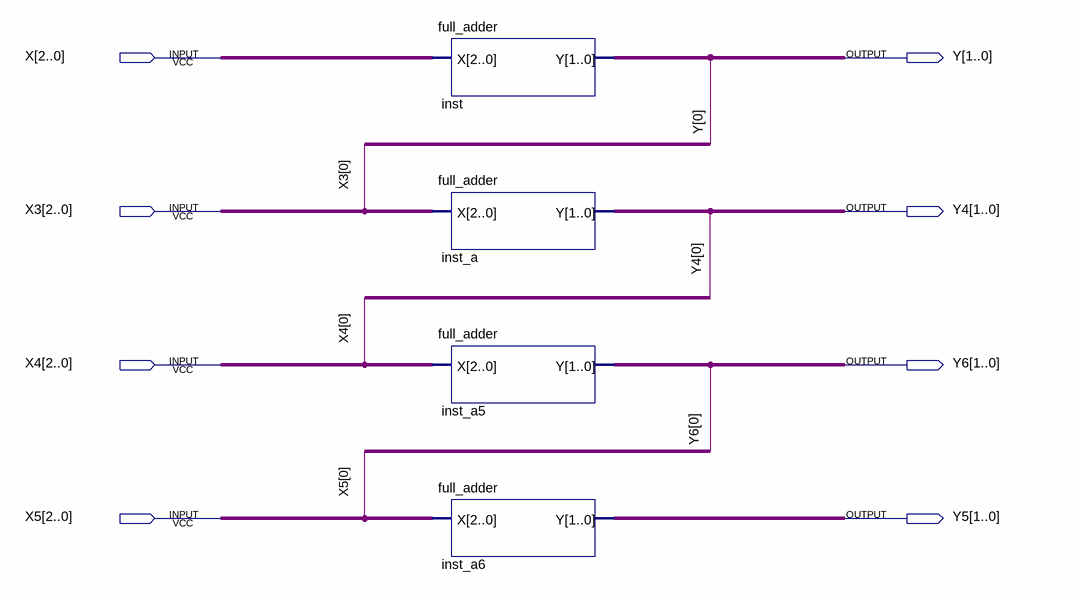
[diagram p0: schematic sheet]
// Quartus schematic fourbitadder.bdf as structural Verilog: 4 symbols, 8 pins
module fourbitadder (
  input  [2:0] X,
  input  [2:0] X3,
  input  [2:0] X4,
  input  [2:0] X5,
  output [1:0] Y,
  output [1:0] Y4,
  output [1:0] Y6,
  output [1:0] Y5
);

  full_adder inst (.X(X), .Y(Y));
  full_adder inst_a (.X(X3), .Y(Y4));
  full_adder inst_a5 (.X(X4), .Y(Y6));
  full_adder inst_a6 (.X(X5), .Y(Y5));
endmodule
